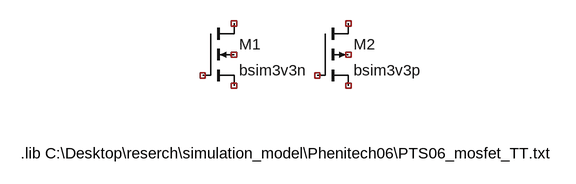
[diagram p0: schematic Draft1.asc]
Draft1.asc, the LTspice schematic file:
Version 4
SHEET 1 880 680
SYMBOL nmos4 128 96 R0
SYMATTR InstName M1
SYMATTR Value bsim3v3n
SYMBOL pmos4 304 96 R0
SYMATTR InstName M2
SYMATTR Value bsim3v3p
TEXT -152 296 Left 2 !.lib C:\\Desktop\\reserch\\simulation_model\\Phenitech06\\PTS06_mosfet_TT.txt

The netlist it stands for:
* Draft1.asc
M1 NC_01 NC_02 NC_03 NC_04 bsim3v3n
M2 NC_05 NC_06 NC_07 NC_08 bsim3v3p
.model NMOS NMOS
.model PMOS PMOS
.lib standard.mos
.lib C:\Desktop\reserch\simulation_model\Phenitech06\PTS06_mosfet_TT.txt
.backanno
.end